# Altium project Şahinbey AKS.PrjPcb
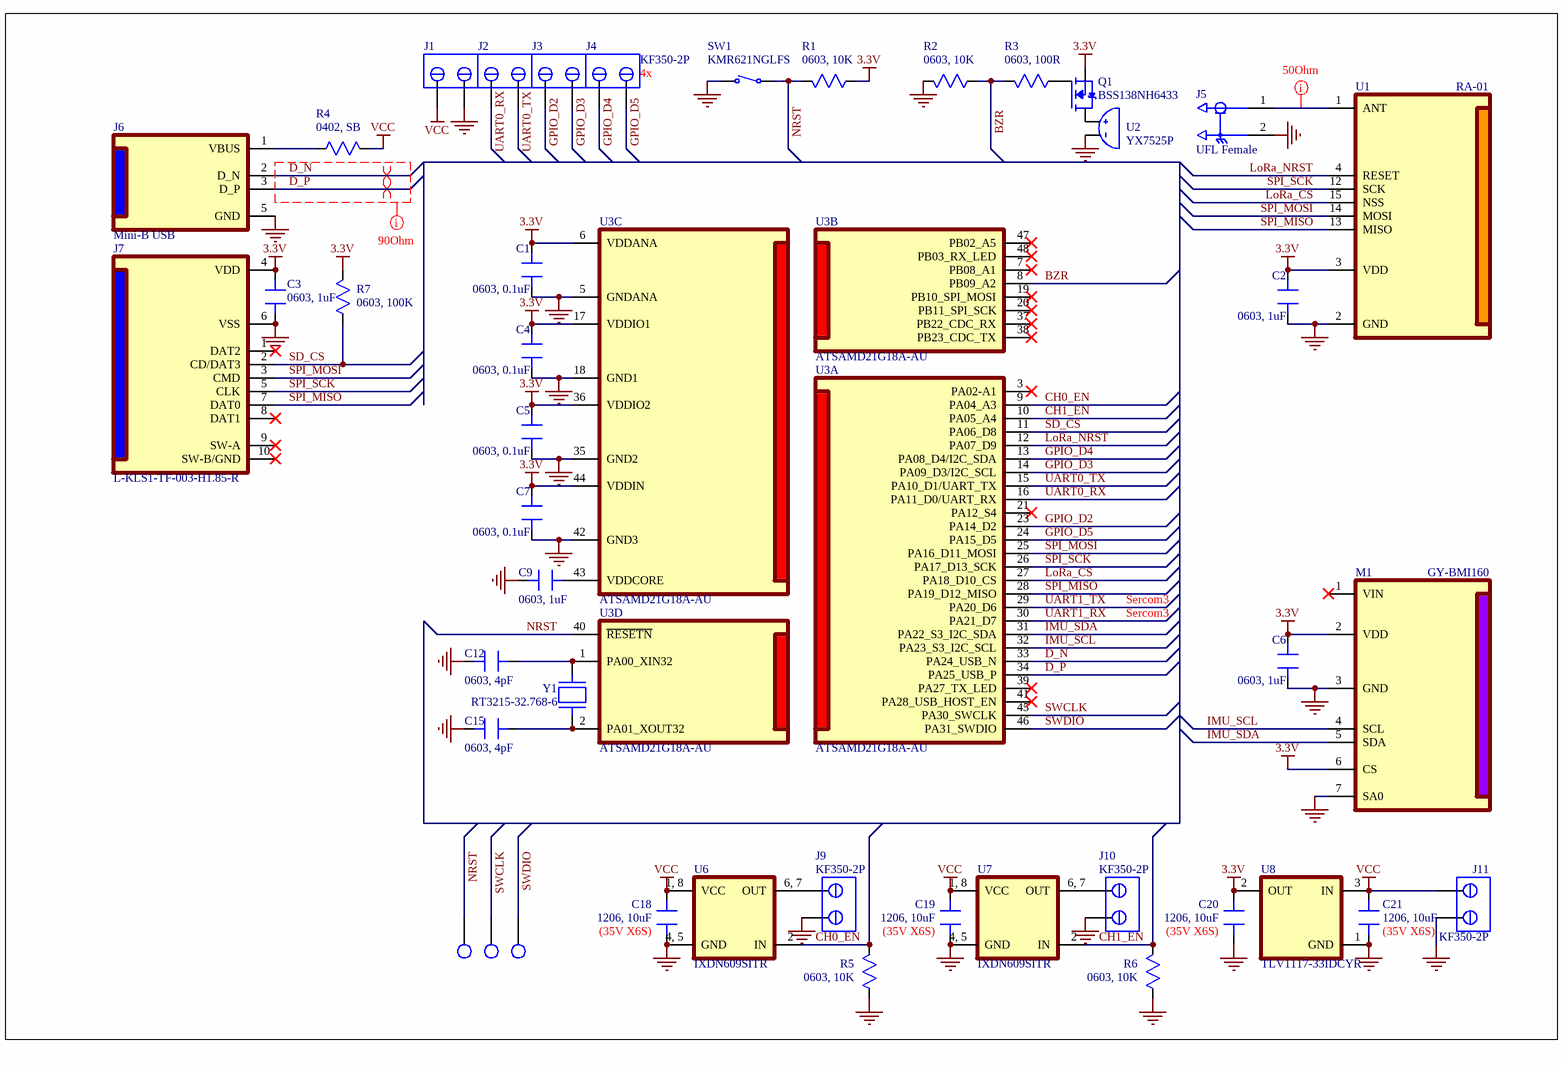
[diagram p0: Main.SchDoc]
1 sheet, 44 parts. Net scope: global (net labels, ports and power ports of the same name join across sheets).
Board file: PCB.PcbDoc

## Sheet Main.SchDoc
size A4; SheetNumber: 1; SheetTotal: 1

### Parts
C1  0603, 0.1uF  [CAP 0603_1608]
C2  0603, 1uF  [CAP 0603_1608]
C3  0603, 1uF  [CAP 0603_1608]
C4  0603, 0.1uF  [CAP 0603_1608]
C5  0603, 0.1uF  [CAP 0603_1608]
C6  0603, 1uF  [CAP 0603_1608]
C7  0603, 0.1uF  [CAP 0603_1608]
C9  0603, 1uF  [CAP 0603_1608]
C12  0603, 4pF  [CAP 0603_1608]
C15  0603, 4pF  [CAP 0603_1608]
C18  1206, 10uF  Parameter 1: (35V X6S)  [CAP 1206_3216]
C19  1206, 10uF  Parameter 1: (35V X6S)  [CAP 1206_3216]
C20  1206, 10uF  Parameter 1: (35V X6S)  [CAP 1206_3216]
C21  1206, 10uF  Parameter 1: (35V X6S)  [CAP 1206_3216]
J1  KF350-2P  [KF350-2P]  (value not drawn)
J2  KF350-2P  [KF350-2P]  (value not drawn)
J3  KF350-2P  [KF350-2P]  (value not drawn)
J4  KF350-2P  [KF350-2P]
J5  UFL Female  [HRS_U.FL-R-SMT(01)]
J6  Mini-B USB  [Mini-B USB]
J7  L-KLS1-TF-003-H1.85-R  [L-KLS1-TF-003-H1.85-R]
J9  KF350-2P  [KF350-2P]
J10  KF350-2P  [KF350-2P]
J11  KF350-2P  [KF350-2P]
M1  GY-BMI160  [GY-BMI160]
P2  Pad  [Pad]  (value not drawn)  (no BOM)
P3  Pad  [Pad]  (value not drawn)  (no BOM)
P4  Pad  [Pad]  (value not drawn)  (no BOM)
Q1  BSS138NH6433  [SOT95P240X111-3N]
R1  0603, 10K  [RES 0603_1608]
R2  0603, 10K  [RES 0603_1608]
R3  0603, 100R  [RES 0603_1608]
R4  0402, SB  [RES 0402_1005]
R5  0603, 10K  [RES 0603_1608]
R6  0603, 10K  [RES 0603_1608]
R7  0603, 100K  [RES 0603_1608]
SW1  KMR621NGLFS  [SW_KMR621NGLFS]
U1  RA-01  [XCVR_RA-01H]
U2  YX7525P  [PCBComponent_1]
U3  ATSAMD21G18A-AU  [QFP50P900X900X120-48N]  (parts A,B,C,D of 4)
U6  IXDN609SITR  [IXDN609SITR]
U7  IXDN609SITR  [IXDN609SITR]
U8  TLV1117-33IDCYR  [SOT230P700X180-4N]
Y1  RT3215-32.768-6  [XTAL_RT3215-32.768-12.5-TR]

### Nets
3.3V: C1.2 C2.2 C3.2 C4.2 C5.2 C6.2 C7.2 C20.2 J7.4(VDD) M1.2(VDD) M1.6(CS) Q1.2(S) R1.1 R7.2 U1.3(VDD) U3.6(VDDANA) U3.17(VDDIO1) U3.36(VDDIO2) U3.44(VDDIN) U8.2(OUT)
GND: C1.1 C2.1 C3.1 C4.1 C5.1 C6.1 C7.1 C9.2 C12.1 C15.1 C18.1 C19.1 C20.1 C21.1 J1.2 J5.2(GND) J6.5(GND) J7.6(VSS) J9.1 J10.1 J11.1 M1.3(GND) M1.7(SA0) R2.2 R5.1 R6.1 SW1.1 U1.2(GND) U2.2 U3.5(GNDANA) U3.18(GND1) U3.35(GND2) U3.42(GND3) U6.4,_5(GND) U7.4,_5(GND) U8.1(GND)
VCC: C18.2 C19.2 C21.2 J1.1 J11.2 R4.2 U6.1,_8(VCC) U7.1,_8(VCC) U8.3(IN)
BZR: R2.1 R3.2 U3.8(PB09_A2)
CH0_EN: R5.2 U3.9(PA04_A3) U6.2(IN)
CH1_EN: R6.2 U3.10(PA05_A4) U7.2(IN)
D_N: J6.2(D_N) U3.33(PA24_USB_N)
D_P: J6.3(D_P) U3.34(PA25_USB_P)
GPIO_D2: J3.1 U3.23(PA14_D2)
GPIO_D3: J3.2 U3.14(PA09_D3/I2C_SCL)
GPIO_D4: J4.1 U3.13(PA08_D4/I2C_SDA)
GPIO_D5: J4.2 U3.24(PA15_D5)
IMU_SCL: M1.4(SCL) U3.32(PA23_S3_I2C_SCL)
IMU_SDA: M1.5(SDA) U3.31(PA22_S3_I2C_SDA)
LoRa_CS: U1.15(NSS) U3.27(PA18_D10_CS)
LoRa_NRST: U1.4(RESET) U3.12(PA07_D9)
NRST: P2.1 R1.2 SW1.2 U3.40(~{RESETN})
SD_CS: J7.2(CD/DAT3) R7.1 U3.11(PA06_D8)
SPI_MISO: J7.7(DAT0) U1.13(MISO) U3.28(PA19_D12_MISO)
SPI_MOSI: J7.3(CMD) U1.14(MOSI) U3.25(PA16_D11_MOSI)
SPI_SCK: J7.5(CLK) U1.12(SCK) U3.26(PA17_D13_SCK)
SWCLK: P3.1 U3.45(PA30_SWCLK)
SWDIO: P4.1 U3.46(PA31_SWDIO)
UART0_RX: J2.1 U3.16(PA11_D0/UART_RX)
UART0_TX: J2.2 U3.15(PA10_D1/UART_TX)
UART1_RX: U3.30(PA21_D7)
UART1_TX: U3.29(PA20_D6)
NetC9_1: C9.1 U3.43(VDDCORE)
NetC12_2: C12.2 U3.1(PA00_XIN32) Y1.2
NetC15_2: C15.2 U3.2(PA01_XOUT32) Y1.1
NetJ5_1: J5.1(SIG) U1.1(ANT)
NetJ6_1: J6.1(VBUS) R4.1
NetJ9_2: J9.2 U6.6,_7(OUT)
NetJ10_2: J10.2 U7.6,_7(OUT)
NetQ1_1: Q1.1(G) R3.1
NetQ1_3: Q1.3(D) U2.1

Not connected (* = marked no-connect by the designer): J7 1(DAT2)* 8(DAT1)* 9(SW-A)* 10(SW-B/GND)*; M1 1(VIN)*; U3 3(PA02-A1)* 7(PB08_A1)* 19(PB10_SPI_MOSI)* 20(PB11_SPI_SCK)* 21(PA12_S4)* 37(PB22_CDC_RX)* 38(PB23_CDC_TX)* 39(PA27_TX_LED)* 41(PA28_USB_HOST_EN)* 47(PB02_A5)* 48(PB03_RX_LED)*

### Layout directives
differential pair: D_N, D_P
rule Differential Pairs Routing [Pref Gap = 7.874mil    Min Gap  = 5mil    Max Gap  = 7.874milPref Width = 5.459mil    Min Width  = 4.099mil    Max Width  = 5.459mil]: D_N, D_P
rule Width Constraint [Pref Impedance = 50.00ohms    Min Impedance = 50.00ohms    Max Impedance = 50.00ohms]: NetJ5_1

### Notes on the sheet
- (near J4) 4x
- Sercom3

### Library data of the parts
C1-C7 C9 C12 C15 = 0603 Kapasitör
C18-C21 = 1206 Kapasitör
J6 = Mini-B USB: MF: Samtec; MP: MUSB-05-F-B-SM-A; SnapEDA_Link: https://www.snapeda.com/parts/MUSB-05-F-B-SM-A/Samtec+Inc./view-part/?ref=snap; Package: None; Value: *; Check_prices: https://www.snapeda.com/parts/MUSB-05-F-B-SM-A/Samtec+Inc./view-part/?ref=eda
Q1 = BSS138NH6433XTMA1
R1-R3 R5-R7 = 0603 Direnç
R4 = 0402 Direnç
U1 = RA-01H
Y1 = RT3215-32.768-12.5-TR